# Altium schematic sheet [01] Schematic.SchDoc
size A
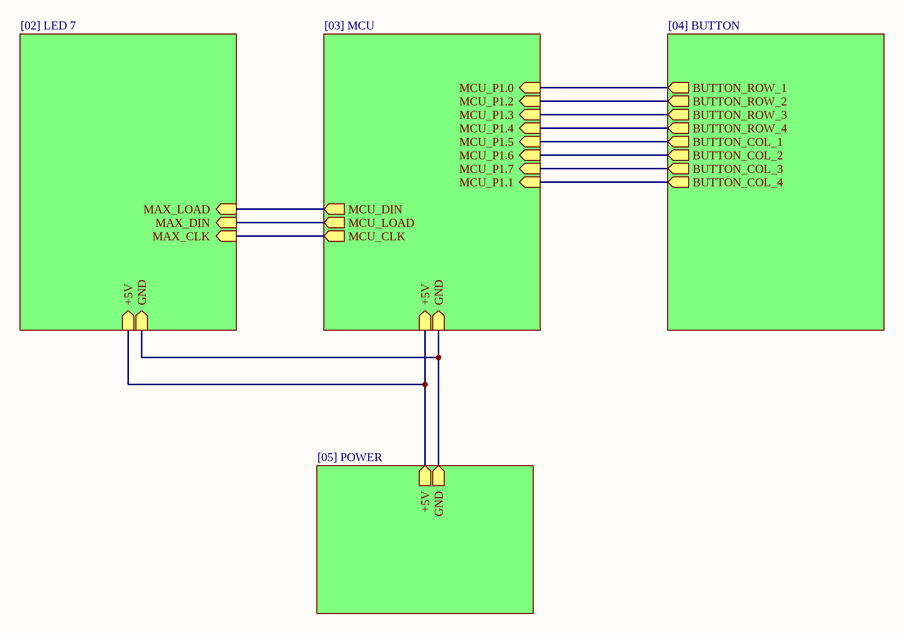
[diagram p0: [01] Schematic.SchDoc]

## Sub-sheets
1 = [02] LED 7: MAX_LOAD (in), MAX_DIN (in), MAX_CLK (in), +5V (in), GND (in)
2 = [03] MCU: MCU_P1.3 (in), MCU_P1.4 (in), MCU_P1.2 (in), MCU_CLK (out), MCU_P1.1 (in), MCU_P1.0 (in), MCU_DIN (out), MCU_LOAD (out), MCU_P1.6 (in), MCU_P1.5 (in), MCU_P1.7 (in), GND (in), +5V (in)
3 = [04] BUTTON: BUTTON_ROW_1 (out), BUTTON_COL_3 (out), BUTTON_COL_1 (out), BUTTON_COL_4 (out), BUTTON_ROW_2 (out), BUTTON_COL_2 (out), BUTTON_ROW_3 (out), BUTTON_ROW_4 (out)
Designator = [05] POWER: GND (out), +5V (out)

## Nets
(unnamed): sheet 1/MAX_LOAD, sheet 2/MCU_DIN
(unnamed): sheet 1/MAX_DIN, sheet 2/MCU_LOAD
(unnamed): sheet 1/MAX_CLK, sheet 2/MCU_CLK
(unnamed): sheet 1/+5V, sheet 2/+5V, sheet Designator/+5V
(unnamed): sheet 1/GND, sheet 2/GND, sheet Designator/GND
(unnamed): sheet 2/MCU_P1.3, sheet 3/BUTTON_ROW_3
(unnamed): sheet 2/MCU_P1.4, sheet 3/BUTTON_ROW_4
(unnamed): sheet 2/MCU_P1.2, sheet 3/BUTTON_ROW_2
(unnamed): sheet 2/MCU_P1.1, sheet 3/BUTTON_COL_4
(unnamed): sheet 2/MCU_P1.0, sheet 3/BUTTON_ROW_1
(unnamed): sheet 2/MCU_P1.6, sheet 3/BUTTON_COL_2
(unnamed): sheet 2/MCU_P1.5, sheet 3/BUTTON_COL_1
(unnamed): sheet 2/MCU_P1.7, sheet 3/BUTTON_COL_3